# Altium schematic sheet Sheet_1_2026-05-26.schdoc
size 190 x 219 mm
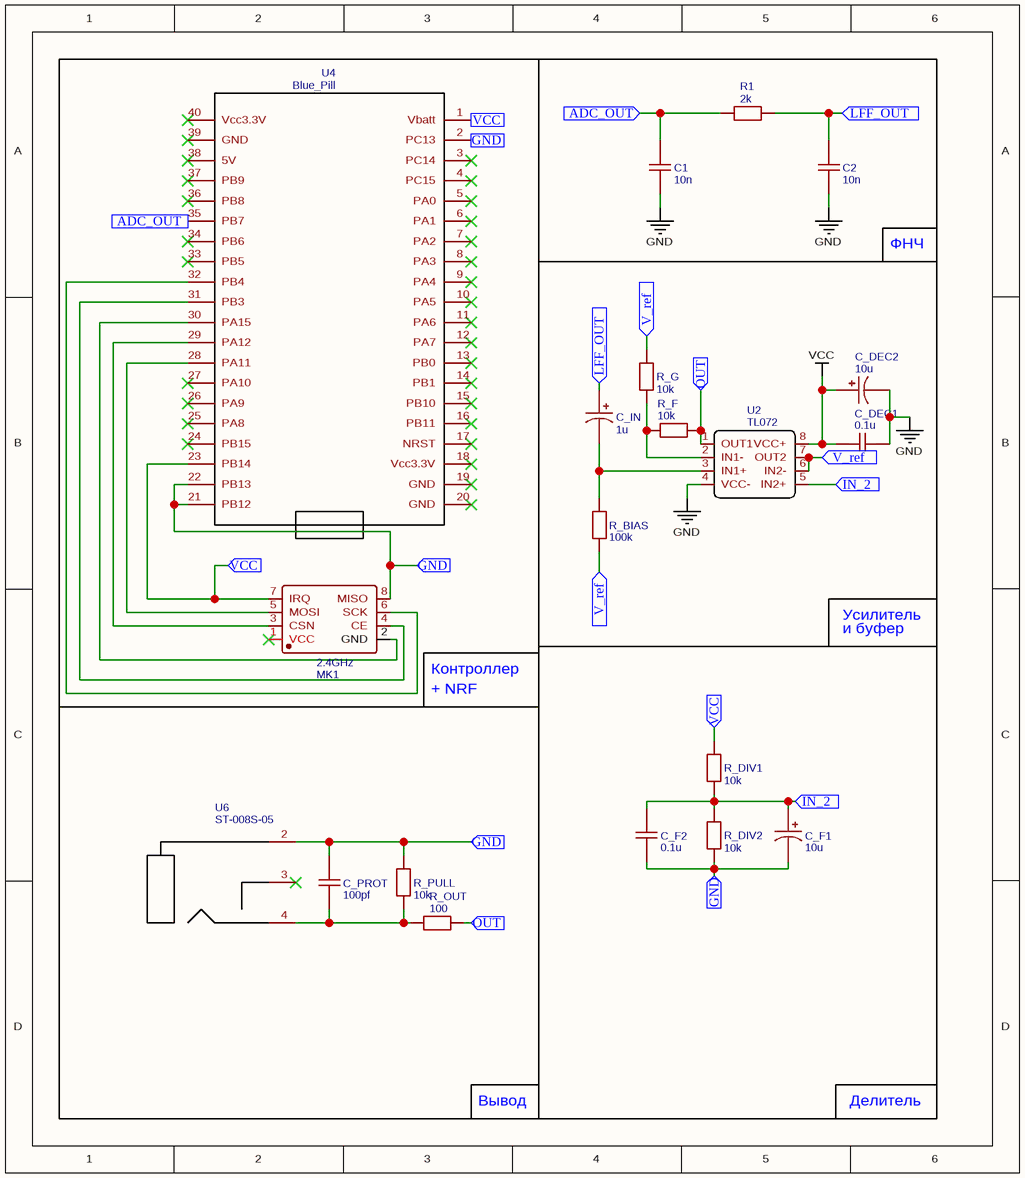
[diagram p0: Sheet_1_2026-05-26.schdoc]

## Parts
C1  10n  [C0603]
C2  10n  [C0603]
C_DEC1  0.1u  [C0603]
C_DEC2  10u  [CAP-D3.0×F1.5]
C_F1  10u  [CAP-D3.0×F1.5]
C_F2  0.1u  [C0603]
C_IN  1u  [CAP-D3.0×F1.5]
C_PROT  100pf  [C0603]
MK1  2.4GHz  [WIRELM-SMD_L28.6-W15.3-P2.54_NRF24L01]
R1  2k  [R0603]
R_BIAS  100k  [R0603]
R_DIV1  10k  [R0603]
R_DIV2  10k  [R0603]
R_F  10k  [R0603]
R_G  10k  [R0603]
R_OUT  100  [R0603]
R_PULL  10k  [R0603]
U2  TL072  [TL072]
U4  Blue_Pill  [STM32F103C8T6-BLUEPILL 1]
U6  ST-008S-05  [ST-008S-05]

## Blocks framed on the sheet
ФНЧ: C1 C2 R1

## Ports
ADC_OUT (in), GND (in), IN_2 (in), LFF_OUT (in), OUT (in), V_ref (in), VCC (in)

## Nets
GND: C1.1 C2.1 C_DEC1.2 C_DEC2.2 U2.4(VCC-)
VCC: C_DEC1.1 C_DEC2.1 U2.8(VCC+)
ADC_OUT: C1.2 R1.1 U4.35(PB7) ; port ADC_OUT
GND: C_F1.2 C_F2.2 C_PROT.2 MK1.8(MISO) R_DIV2.2 R_PULL.2 U4.2(PC13) U4.21(PB12) U4.22(PB13) U6.2 ; port GND  [a separate net that carries the same name]
IN_2: C_F1.1 C_F2.1 R_DIV1.2 R_DIV2.1 U2.5(IN2+) ; port IN_2
LFF_OUT: C2.2 C_IN.1 R1.2 ; port LFF_OUT
OUT: R_F.2 R_OUT.2 U2.1(OUT1) ; port OUT
V_ref: R_BIAS.1 R_G.1 U2.6(IN2-) U2.7(OUT2) ; port V_ref
VCC: MK1.7(IRQ) R_DIV1.1 U4.1(Vbatt) U4.23(PB14) ; port VCC  [a separate net that carries the same name]
NetC_IN_2: C_IN.2 R_BIAS.2 U2.3(IN1+)
NetC_PROT_1: C_PROT.1 R_OUT.1 R_PULL.1 U6.4
NetMK1_2: MK1.2(GND) U4.30(PA15)
NetMK1_3: MK1.3(CSN) U4.29(PA12)
NetMK1_4: MK1.4(CE) U4.31(PB3)
NetMK1_5: MK1.5(MOSI) U4.28(PA11)
NetMK1_6: MK1.6(SCK) U4.32(PB4)
NetR_F_1: R_F.1 R_G.2 U2.2(IN1-)

Not connected (* = marked no-connect by the designer): MK1 1(VCC)*; U4 3(PC14)* 4(PC15)* 5(PA0)* 6(PA1)* 7(PA2)* 8(PA3)* 9(PA4)* 10(PA5)* 11(PA6)* 12(PA7)* 13(PB0)* 14(PB1)* 15(PB10)* 16(PB11)* 17(NRST)* 18(Vcc3.3V)* 19(GND)* 20(GND)* 24(PB15)* 25(PA8)* 26(PA9)* 27(PA10)* 33(PB5)* 34(PB6)* 36(PB8)* 37(PB9)* 38(5V)* 39(GND)* 40(Vcc3.3V)*; U6 3*

## Notes on the sheet
- Усилитель
- и буфер
- Контроллер
- + NRF
- Вывод
- Делитель

## Library data of the parts
C1 C2 = 10n: nameAlias: Value(F); Contributor: LCEDA_Lib; spicePre: C; spiceSymbolName: C_0603_US
C_DEC1 C_F2 = 0.1u: nameAlias: Value(F); Contributor: LCEDA_Lib; spicePre: C; spiceSymbolName: C_0603_US
C_DEC2 C_F1 = 10u: nameAlias: Value(F); Contributor: LCEDA_Lib; spicePre: C; spiceSymbolName: CE_TH_D3.0×F1.5_US
C_IN = 1u: nameAlias: Value(F); Contributor: LCEDA_Lib; spicePre: C; spiceSymbolName: CE_TH_D3.0×F1.5_US
C_PROT = 100pf: nameAlias: Value(F); Contributor: LCEDA_Lib; spicePre: C; spiceSymbolName: C_0603_US
MK1 = 2.4GHz: Manufacturer: Ai-Thinker(安信可); Manufacturer Part: NF-04; nameAlias: Value; Supplier: LCSC; Supplier Part: C90751; JLCPCB Part Class: Extended Part; spicePre: M; spiceSymbolName: NRF24L01
R1 = 2k: nameAlias: Value(Ω); Contributor: LCEDA_Lib; spicePre: R; spiceSymbolName: R_0603_EU
R_BIAS = 100k: nameAlias: Value(Ω); Contributor: LCEDA_Lib; spicePre: R; spiceSymbolName: R_0603_EU
R_DIV1 R_DIV2 R_F R_G R_PULL = 10k: nameAlias: Value(Ω); Contributor: LCEDA_Lib; spicePre: R; spiceSymbolName: R_0603_EU
R_OUT = 100: nameAlias: Value(Ω); Contributor: LCEDA_Lib; spicePre: R; spiceSymbolName: R_0603_EU
U2 = TL072: Contributor: dmitrukvoloda; spicePre: U; spiceSymbolName: TL072
U4 = Blue_Pill: Manufacturer Part: STM32Duino; Contributor: gianpysurf; spicePre: U; spiceSymbolName: Blue_Pill
U6 = ST-008S-05: Contributor: danik_mus; spicePre: U; spiceSymbolName: ST-008S-05